# Altium schematic sheet 12V DC-DC ISOLATOR.SchDoc
size B; Organization: Altium Limited; Address1: L3, 12a Rodborough Rd; Address2: Frenchs Forest; Address3: NSW; Address4: Australia 2086; SheetNumber: 1; SheetTotal: 1
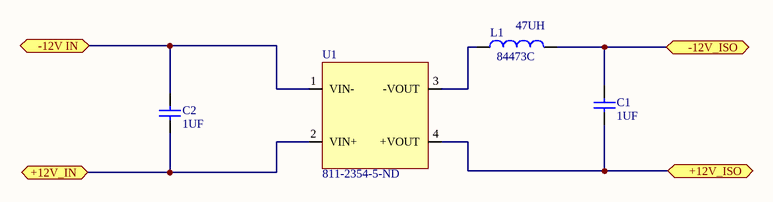
[diagram p0: 12V DC-DC ISOLATOR.SchDoc]

## Parts
C1  Capacitance: 1UF  [CAP0805_NEW]  (hidden comment: CC0805JKX7R9BB105)
C2  Capacitance: 1UF  [CAP0805_NEW]  (hidden comment: CC0805JKX7R9BB105)
L1  Inductance: 47UH  [INDC5435X06N]  (hidden comment: 84473C)
U1  Supplier Part Number 1: 811-2354-5-ND  [MEE3S1212SC]  (hidden comment: MEE3S1212SC)

## Ports
+12V_IN, +12V_ISO, -12V IN, -12V_ISO

## Nets
+12V_IN: C2.1 U1.2(VIN+) ; port +12V_IN
+12V_ISO: C1.1 U1.4(+VOUT) ; port +12V_ISO
-12V IN: C2.2 U1.1(VIN-) ; port -12V IN
-12V_ISO: C1.2 L1.2 ; port -12V_ISO
NetL1_1: L1.1 U1.3(-VOUT)

## Notes on the sheet
- Title:
- Size:
- B
- Document Number:
- Revision:
- Designer:
- Approval Date:
- Start Date:
- MM/DD/YY
- --/--/--
- Sheet:
- of
- Approver:
- CONFIDENTIAL
- Project Name/Number:

## Library data of the parts
C1 C2 = CC0805JKX7R9BB105: CAP CER 1UF 50V X7R 0805; Manufacturer: Yageo; Tolerance: ±5%; Supplier 1: Digi-Key; Manufacturer Part Number: CC0805JKX7R9BB105; RoHS: RoHS Compliant; Category: Capacitors; Stock 1: 1863; Pricing 1: 1=0.34, 10=0.231, 100=0.131, 500=0.09248, 1000=0.08093 (USD); Packaging: Cut Tape (CT); Part Status: Active; Voltage - Rated: 50V; Temperature Coefficient: X7R; Operating Temperature: -55°C ~ 125°C; Features: -; Ratings: -; Applications: General Purpose; Failure Rate: -; Mounting Type: Surface Mount, MLCC; Package / Case: 0805 (2012 Metric); Size / Dimension: 0.079" L x 0.049" W (2.00mm x 1.25mm); Height - Seated (Max): -; Thickness (Max): 0.057" (1.45mm); Lead Spacing: -; Lead Style: -; ComponentLink1URL: http://www.yageo.com/documents/recent/UPY-GPHC_X7R_6.3V-to-50V_18.pdf; ComponentLink1Description: http://www.yageo.com/documents/recent/UPY-GPHC_X7R_6.3V-to-50V_18.pdf; Supplier Part Number 1: 311-3498-1-ND
L1 = 84473C: FIXED IND 47UH 420MA 1.1 OHM; Manufacturer: Murata Power Solutions Inc.; Type: Wirewound; Tolerance: ±10%; Shielding: Unshielded; DC Resistance (DCR): 1.1 Ohm Max; Supplier 1: Digi-Key; Manufacturer Part Number: 84473C; RoHS: RoHS Compliant; Category: Inductors, Coils, Chokes; Stock 1: 1447; Pricing 1: 1=0.53, 10=0.493, 100=0.323, 500=0.26002 (USD); Packaging: Cut Tape (CT); Part Status: Active; Material - Core: -; Q @ Freq: -; Ratings: -; Operating Temperature: -40°C ~ 125°C; Mounting Type: Surface Mount; Package / Case: Nonstandard; Size / Dimension: 0.177" L x 0.130" W (4.50mm x 3.30mm); Height - Seated (Max): 0.114" (2.90mm); ComponentLink1URL: http://www.murata-ps.com/data/magnetics/kmp_8400.pdf; ComponentLink1Description: http://www.murata-ps.com/data/magnetics/kmp_8400.pdf; Supplier Part Number 1: 811-3119-1-ND
U1 = MEE3S1212SC: DC/DC CONVERTER 12V 3W ISOLATED; Manufacturer: Murata Power Solutions Inc.; Number of Outputs: 1; Voltage - Input (Min): 10.8V; Voltage - Input (Max): 13.2V; Current - Output (Max): 250mA; Voltage - Isolation: 1kV (1000V); Efficiency: 88%; Supplier 1: Digi-Key; Manufacturer Part Number: MEE3S1212SC; RoHS: RoHS Compliant; Category: Power Supplies - Board Mount; Stock 1: 411; Pricing 1: 1=11.84, 5=11.78, 10=11.7, 25=11.57, 50=11.28, 100=10.72, 250=10.03004, 500=9.35004, 1000=9.31 (USD); Packaging: Tube; Part Status: Active; Type: Isolated Module; Voltage - Output 1: 12V; Voltage - Output 2: -; Voltage - Output 3: -; Power (Watts): 3W; Applications: ITE (Commercial); Features: -; Operating Temperature: -40°C ~ 85°C; Mounting Type: Through Hole; Package / Case: 4-SIP Module; Size / Dimension: 0.56" L x 0.32" W x 0.40" H (14.2mm x 8.2mm x 10.2mm); ComponentLink1URL: http://power.murata.com/data/power/ncl/kdc_mee3.pdf; ComponentLink1Description: http://power.murata.com/data/power/ncl/kdc_mee3.pdf